# EAGLE design Ver2 (EAGLE 9.2.0)
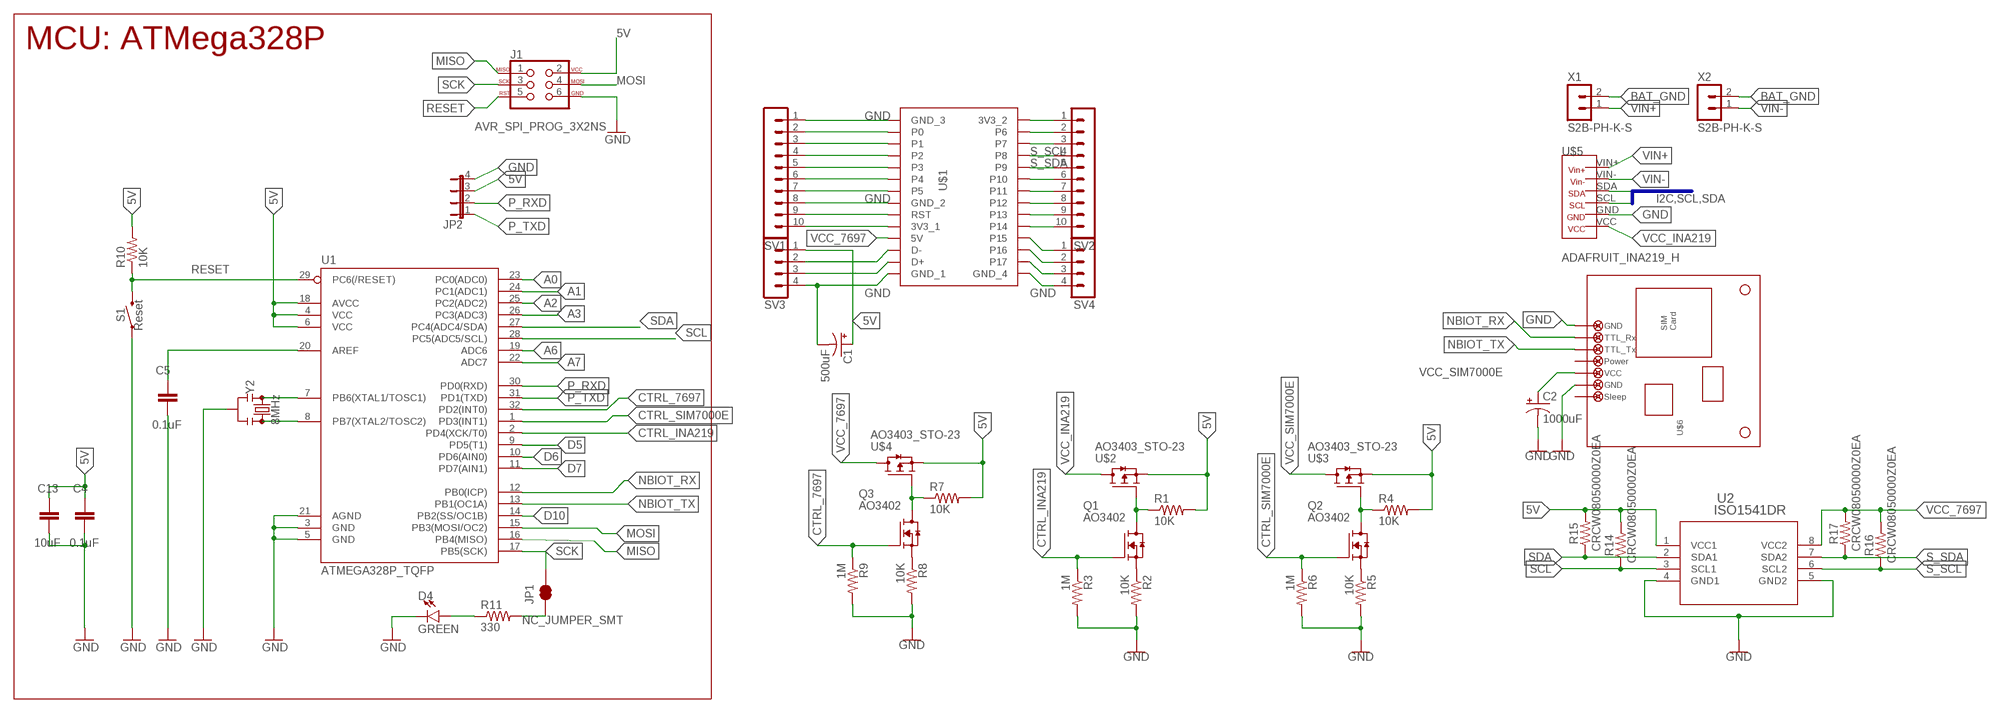
[diagram p0: schematic, sheet 1]

## Parts
C1  500uF  CPOL-USTT2D5  [TT2D5]
C2  1000uF  CPOL-USTT2D5L  [TT2D5L]
C4  0.1uF  CC0805KRX7R9BB104  [CAP_0805]
C5  0.1uF  CC0805KRX7R9BB104  [CAP_0805]
C13  10uF  CC0805KRX7R9BB104  [CAP_0805]
D4  GREEN  LED-GREEN0603  [LED-0603]
J1  AVR_SPI_PROG_3X2NS  [2X3-NS]
JP1  NC_JUMPER_SMT  JUMPER-SMT_2_NC_TRACE_SILK  [SMT-JUMPER_2_NC_TRACE_SILK]
JP2  JP4E  [JP4]
Q1  AO3402  [SOT95P280X125-3N]
Q2  AO3402  [SOT95P280X125-3N]
Q3  AO3402  [SOT95P280X125-3N]
R1  10K  CRCW08050000Z0EA  [RES_0805]
R2  10K  CRCW08050000Z0EA  [RES_0805]
R3  1M  CRCW08050000Z0EA  [RES_0805]
R4  10K  CRCW08050000Z0EA  [RES_0805]
R5  10K  CRCW08050000Z0EA  [RES_0805]
R6  1M  CRCW08050000Z0EA  [RES_0805]
R7  10K  CRCW08050000Z0EA  [RES_0805]
R8  10K  CRCW08050000Z0EA  [RES_0805]
R9  1M  CRCW08050000Z0EA  [RES_0805]
R10  10K  CRCW08050000Z0EA  [RES_0805]
R11  330  CRCW08050000Z0EA  [RES_0805]
R14  CRCW08050000Z0EA  [RES_0805]
R15  CRCW08050000Z0EA  [RES_0805]
R16  CRCW08050000Z0EA  [RES_0805]
R17  CRCW08050000Z0EA  [RES_0805]
S1  Reset  MOMENTARY-SWITCH-SPST-SMD-4.5MM  [TACTILE_SWITCH_SMD_4.5MM]
SV1  MA10-1  [MA10-1]
SV2  MA10-1  [MA10-1]
SV3  MA04-1  [MA04-1]
SV4  MA04-1  [MA04-1]
U1  ATMEGA328P_TQFP  [TQFP32-08]
U2  ISO1541DR  [D8]
U$1  LINKIT_7697  [LINKIT_7697]
U$2  AO3403_STO-23  [SOT23]
U$3  AO3403_STO-23  [SOT23]
U$4  AO3403_STO-23  [SOT23]
U$5  ADAFRUIT_INA219_H  [ADAFRUIT_INA219_H]
U$6  SIM7000E  [SIM7000E_AND-GLOBAL]
X1  S2B-PH-K-S  [S2B-PH-K-S]
X2  S2B-PH-K-S  [S2B-PH-K-S]
Y2  8MHz  RESONATOR-8MHZSMD_3.2X1.3  [RESONATOR-SMD-3.2X1.3]

## Nets
5V: C1.+ C4.1 C13.1 J1.2 JP2.3 R1.2 R4.2 R7.2 R10.2 R14.2 R15.2 SV3.1 U1.4(VCC) U1.6(VCC) U1.18(AVCC) U2.1(VCC1) U$2.2(S) U$3.2(S) U$4.2(S)
A0: U1.23(PC0(ADC0))
A1: U1.24(PC1(ADC1))
A2: U1.25(PC2(ADC2))
A3: U1.26(PC3(ADC3))
A6: U1.19(ADC6)
A7: U1.22(ADC7)
BAT_GND: X1.2 X2.2
CTRL_7697: Q3.1(G) R9.1 U1.32(PD2(INT0))
CTRL_INA219: Q1.1(G) R3.1 U1.2(PD4(XCK/T0))
CTRL_SIM7000E: Q2.1(G) R6.1 U1.1(PD3(INT1))
D5: U1.9(PD5(T1))
D6: U1.10(PD6(AIN0))
D7: U1.11(PD7(AIN1))
D10: U1.14(PB2(SS/OC1B))
GND: C1.- C2.- C4.2 C5.2 C13.2 D4.C J1.6 JP2.4 R2.2 R3.2 R5.2 R6.2 R8.2 R9.2 S1.2 S1.3 SV1.1 SV1.8 SV3.4 SV4.4 U1.3(GND) U1.5(GND) U1.21(AGND) U2.4(GND1) U2.5(GND2) U$1.GND_1 U$1.GND_2 U$1.GND_3 U$1.GND_4 U$5.GND U$6.S_GND U$6.V_GND Y2.2
MISO: J1.1 U1.16(PB4(MISO))
MOSI: J1.4 U1.15(PB3(MOSI/OC2))
N$1: Q1.2(S) R2.1
N$2: Q1.3(D) R1.1 U$2.1(G)
N$3: Q2.2(S) R5.1
N$4: Q2.3(D) R4.1 U$3.1(G)
N$5: Q3.2(S) R8.1
N$6: Q3.3(D) R7.1 U$4.1(G)
N$7: U1.7(PB6(XTAL1/TOSC1)) Y2.1
N$8: SV1.2 U$1.P0
N$9: SV1.3 U$1.P1
N$10: SV1.4 U$1.P2
N$11: SV1.5 U$1.P3
N$12: SV1.6 U$1.P4
N$13: SV1.7 U$1.P5
N$14: U1.8(PB7(XTAL2/TOSC2)) Y2.3
N$15: SV1.9 U$1.RST
N$16: SV1.10 U$1.3V3_1
N$17: SV3.2 U$1.D-
N$18: SV3.3 U$1.D+
N$19: C5.1 U1.20(AREF)
N$20: JP1.1 R11.2
N$21: SV4.3 U$1.P17
N$22: SV4.2 U$1.P16
N$23: SV4.1 U$1.P15
N$24: SV2.10 U$1.P14
N$25: SV2.9 U$1.P13
N$26: SV2.8 U$1.P12
N$27: SV2.7 U$1.P11
N$28: SV2.6 U$1.P10
N$29: D4.A R11.1
N$31: SV2.3 U$1.P7
N$32: SV2.2 U$1.P6
N$33: SV2.1 U$1.3V3_2
NBIOT_RX: U1.12(PB0(ICP)) U$6.RX
NBIOT_TX: U1.13(PB1(OC1A)) U$6.TX
P_RXD: JP2.2 U1.30(PD0(RXD))
P_TXD: JP2.1 U1.31(PD1(TXD))
RESET: J1.5 R10.1 S1.1 S1.4 U1.29(PC6(/RESET))
S_SCL: R16.1 SV2.4 U2.6(SCL2) U$1.P8
S_SDA: R17.1 SV2.5 U2.7(SDA2) U$1.P9
SCK: J1.3 JP1.2 U1.17(PB5(SCK))
SCL: R14.1 U1.28(PC5(ADC5/SCL)) U2.3(SCL1) U$5.SCL
SDA: R15.1 U1.27(PC4(ADC4/SDA)) U2.2(SDA1) U$5.SDA
VCC_7697: R16.2 R17.2 U2.8(VCC2) U$1.5V U$4.3(D)
VCC_INA219: U$2.3(D) U$5.VCC
VCC_SIM7000E: C2.+ U$3.3(D) U$6.VCC
VIN+: U$5.VIN+ X1.1
VIN-: U$5.VIN- X2.1
Unconnected: U$6.PW U$6.SLEEP

## Buses
I2C,SCL,SDA

## Notes on the sheet
- MCU: ATMega328P

## Library data of the parts
C1 C2 = rcl:CPOL-US: POLARIZED CAPACITOR, American symbol; SPICEPREFIX: C
C4 C5 C13 = Resistor_Capacitor:CC0805KRX7R9BB104: CAP CER 0.1UF 50V X7R 0805 Manufacturer's datasheet <http://www.yageo.com/documents/recent/UPY-GPHC_X7R_6.3V-to-50V_18.pdf>; CREATED_BY: PCBLayout.com; DIGIKEY_PART_NUMBER: 311-1140-2-ND; MANUFACTURER: Yageo; MPN: CC0805KRX7R9BB104; PACKAGE: SMD 0805
D4 = SparkFun-LED:LED-GREEN: Green SMD LED Used in manufacturing of various products at SparkFun Packages: 0603 - SMD 0603 package [Product Link] <http://www.futureelectronics.com/en/technologies/semiconductors/optoelectronics/leds/Pages/9894312-LTST-C190GKT.aspx?CrossPart=HSMG-C190&IM=0> LilyPad 1206 - SMD1206 LilyPad package [Product Link] <http://www.futureelectronics.com/en/Technologies/Product.aspx?ProductID=IN150NGHARVATEKCORPORATION2049943&IM=0> 1206 - SMD1206 package [Product Link] <http://www.futureelectronics.com/en/technologies/semiconductors/optoelectronics/leds/Pages/8315665-LTST-C150KGKT.aspx?IM=0> 1206 Bottom Mount -SMD 1206 Bottom Mount [Product Link] <http://www.digikey.com/product-detail/en/lite-on-inc/LTST-C230KGKT/160-1456-1-ND/386854> SparkFun Products: Pro Mini 328 -5V <https://www.sparkfun.com/products/821> RedBoard <https://www.sparkfun.com/products/12757> MP3 Trigger <https://www.sparkfun.com/products/13720> Makey Makey <https://www.sparkfun.com/products/11076>; PROD_ID: DIO-00821
J1 = SparkFun-Connectors:AVR_SPI_PROG_3X2: AVR ISP 6 Pin This is the reduced ISP connector for AVR programming. Common on Arduino. This footprint will take up less PCB space and can be used with a 10-pin to 6-pin adapter such as SKU: BOB-08508 **Special note about "TEST_POINT" package. The stop mask is on the top side, so if you want your programming test points to be on the bottom of your board, make sure to place this package on the bottom side of the board. This also ensure that the orientation to program from the bottom side will be correct. SparkFun Products: SparkFun ISP Pogo Adapter <https://www.sparkfun.com/products/11591> - NS Tiny AVR Programmer <https://www.sparkfun.com/products/11801> -PTH
JP1 = SparkFun-Jumpers:JUMPER-SMT_2_NC_TRACE: Normally closed trace jumper This jumper has a trace between two pads so it's normally closed (NC). Use a razor knife to open the connection. For best results follow the IPC guidelines for cutting traces: Cutout at least 0.063 mm (0.005 in). Remove all loose material to clean up the cut area. Seal the cut with an approved epoxy. Reapply solder to reclose the connection.
JP2 = jumper:JP4E: JUMPER
Q1-Q3 = AO340x:AO3402: MOSFET N-CH 30V 4.0A SOT23; AVAILABILITY: Unavailable; DESCRIPTION: N-Channel 30V 4A _Ta_ 1.4W _Ta_ Surface Mount SOT-23-3L; MF: Alpha &; MP: AO3402; PACKAGE: SOT-23 Alpha &amp; Omega Semiconductor; PRICE: None
R1-R11 R14-R17 = Resistor_Capacitor:CRCW08050000Z0EA: RES SMD 0 OHM JUMPER 1/8W 0805 Manufacturer's datasheet <http://www.vishay.com/docs/20035/dcrcwe3.pdf>; CREATED_BY: PCBLayout.com; DIGIKEY_PART_NUMBER: 541-0.0ATR-ND; MANUFACTURER: Vishay Dale; MPN: CRCW08050000Z0EA; PACKAGE: SMD 0805
S1 = SparkFun-Switches:MOMENTARY-SWITCH-SPST: Momentary Switch (Pushbutton) - SPST Normally-open (NO) SPST momentary switches (buttons, pushbuttons). Variants PTH-12MM - 12mm square, through-hole Momentary Pushbutton Switch - 12mm Square <https://www.sparkfun.com/products/9190> (COM-09190) PTH-6.0MM, PTH-6.0MM-KIT - 6.0mm square, through-hole Mini Pushbutton Switch <https://www.sparkfun.com/products/97> (COM-00097) KIT package intended for soldering kit's - only one side of pads' copper is exposed. PTH-RIGHT-ANGLE-KIT - Right-angle, through-hole Right Angle Tactile Button <https://www.sparkfun.com/products/10791> - Used on SparkFun BigTime Watch Kit <https://www.sparkfun.com/products/11734> SMD-12MM - 12mm square, surface-mount Tactile Button - SMD (12mm) <https://www.sparkfun.com/products/12993> (COM-12993) Used on SparkFun PicoBoard <https://www.sparkfun.com/products/11888> SMD-4.5MM - 4.5mm Square Trackball Switch Used on SparkFun Blackberry Trackballer Breakout <https://www.sparkfun.com/products/13169> SMD-4.6MMX2.8MM - 4.60mm x 2.80mm, surface mount Used on SparkFun SAMD21 Mini Breakout <https://www.sparkfun.com/products/13664> SMD-5.2MM, SMD-5.2-REDUNDANT - 5.2mm square, surface-mount Mini Pushbutton Switch - SMD <https://www.sparkfun.com/products/8720> (COM-08720) Used on Arduino Pro Mini <https://www.sparkfun.com/products/11114> REDUNDANT package connects both switch circuits together SMD-6.0X3.5MM - 6.0 x 3.5mm, surface mount Momentary Reset Switch SMD <https://www.sparkfun.com/products/8229> (COM-08229) SMD-6.2MM-TALL - 6.2mm square, surface mount Tactile Button - SMD (6mm) <https://www.sparkfun.com/products/12992> Used on SparkFun Digital Sandbox <https://www.sparkfun.com/products/12651> SMD-RIGHT-ANGLE - Right-angle, surface mount Used on SparkFun Block for Intel® Edison - Arduino <https://www.sparkfun.com/products/13036>; PROD_ID: SWCH-09213
SV1 SV2 = con-lstb:MA10-1: PIN HEADER; OC_FARNELL: unknown; OC_NEWARK: unknown
SV3 SV4 = con-lstb:MA04-1: PIN HEADER; OC_FARNELL: unknown; OC_NEWARK: unknown
U1 = GAIA_LoRaMesh:ATMEGA328P_TQFP: Popular 328P in QFP Storefront component: ATmega328 - TQFP <https://www.sparkfun.com/products/13448> (COM-13448) Datasheet <http://www.sparkfun.com/datasheets/Components/SMD/ATMega328.pdf> SparkFun Products SparkFun RedBoard - Programmed with Arduino <https://www.sparkfun.com/products/12757> (DEV-12757) Arduino Pro Mini 328 - 5V/16MHz <https://www.sparkfun.com/products/11113> (DEV-11113) Arduino Pro Mini 328 - 3.3V/8MHz <https://www.sparkfun.com/products/11114> (DEV-11114) SparkFun OpenLog <https://www.sparkfun.com/products/13712> (DEV-13712) SparkFun MicroView - OLED Arduino Module <https://www.sparkfun.com/products/12923> (DEV-12923) SparkFun Digital Sandbox <https://www.sparkfun.com/products/12651> (DEV-12651) SparkFun PicoBoard <https://www.sparkfun.com/products/11888> (WIG-11888) Arduino Fio <https://www.sparkfun.com/products/10116> (DEV-10116) LilyPad Arduino 328 Main Board <https://www.sparkfun.com/products/13342> (DEV-13342) SparkFun RedStick <https://www.sparkfun.com/products/13741> (DEV-13741) LilyPad MP3 <https://www.sparkfun.com/products/11013> (DEV-11013) LilyPad Arduino SimpleSnap <https://www.sparkfun.com/products/10941> (DEV-10941) SparkFun Stepoko <https://www.sparkfun.com/products/13899> (ROB-13899) SparkFun Geiger Counter <https://www.sparkfun.com/products/11345> (SEN-11345) SparkFun EL Sequencer <https://www.sparkfun.com/products/12781> (COM-12781) Arduino Pro 328 - 5V/16MHz <https://www.sparkfun.com/products/10915> (DEV-10915) CryptoCape <https://www.sparkfun.com/products/12773> (DEV-12773) SparkFun IR Thermometer Evaluation Board - MLX90614 <https://www.sparkfun.com/products/10740> (SEN-10740) SparkFun RedBot Mainboard <https://www.sparkfun.com/products/12097> (ROB-12097) Arduino Pro 328 - 3.3V/8MHz <https://www.sparkfun.com/products/10914> (DEV-10914) SparkFun Block for Intel® Edison - Arduino <https://www.sparkfun.com/products/13036> (DEV-13036) SparkFun Simon Says - Surface Mount Soldering Kit <https://www.sparkfun.com/products/10935> (KIT-10935) SparkFun 7-Segment Serial Display - Red <https://www.sparkfun.com/products/11441> (COM-11441) SparkFun 7-Segment Serial Display - White <https://www.sparkfun.com/products/11629> (COM-11629) SparkFun 7-Segment Serial Display - Yellow <https://www.sparkfun.com/products/11443> (COM-11443) SparkFun 7-Segment Serial Display - Kelly Green <https://www.sparkfun.com/products/11440> (COM-11440) SparkFun 7-Segment Serial Display - Blue <https://www.sparkfun.com/products/11442> (COM-11442) SparkFun OpenSegment Serial Display - 20mm (Blue) <https://www.sparkfun.com/products/11647> (COM-11647) SparkFun OpenSegment Serial Display - 20mm (Green) <https://www.sparkfun.com/products/11646> (COM-11646) SparkFun OpenSegment Serial Display - 20mm (White) <https://www.sparkfun.com/products/11648> (COM-11648) SparkFun OpenSegment Serial Display - 20mm (Red) <https://www.sparkfun.com/products/11644> (COM-11644) SparkFun OpenSegment Serial Display - 20mm (Yellow) <https://www.sparkfun.com/products/11645> (COM-11645) SparkFun OpenSegment Shield <https://www.sparkfun.com/products/13190> (DEV-13190); PROD_ID: IC-09069
U2 = IC_I2CIsolator_ISO1451DR:ISO1541DR; BUILT_BY: EMA_UL_Team; MANUFACTURER_PART_NUMBER: ISO1541DR; VENDOR: Texas Instruments
U$1 = MCU:LINKIT_7697
U$2-U$4 = AO340x:AO3403
U$5 = GAIA_SedimentCurrentFlowBox:ADAFRUIT_INA219_H
U$6 = GAIA_SedimentCurrentFlowBox:SIM7000E
X1 X2 = con-JST PH:S2B-PH: JST PH series header 2.00mm pitch disconnectable crimp style connectors, horizontal (side entry type), 2 pins
Y2 = SparkFun-Clocks:RESONATOR-8MHZ: 8MHz Resonator Digikey Example <http://www.digikey.com/product-detail/en/murata-electronics-north-america/CSTCE10M0G55-R0/490-1196-1-ND/584633> Frequency: 8MHz Frequency Stability: ±0.2% Frequency Tolerance: ±0.5% Capacitance: 33pF SparkFun Products Arduino Pro Mini 328- 3.3V/8MHz <https://www.sparkfun.com/products/11114> SparkFun Digital Sandbox <https://www.sparkfun.com/products/12651>; PROD_ID: XTAL-08895

## Board
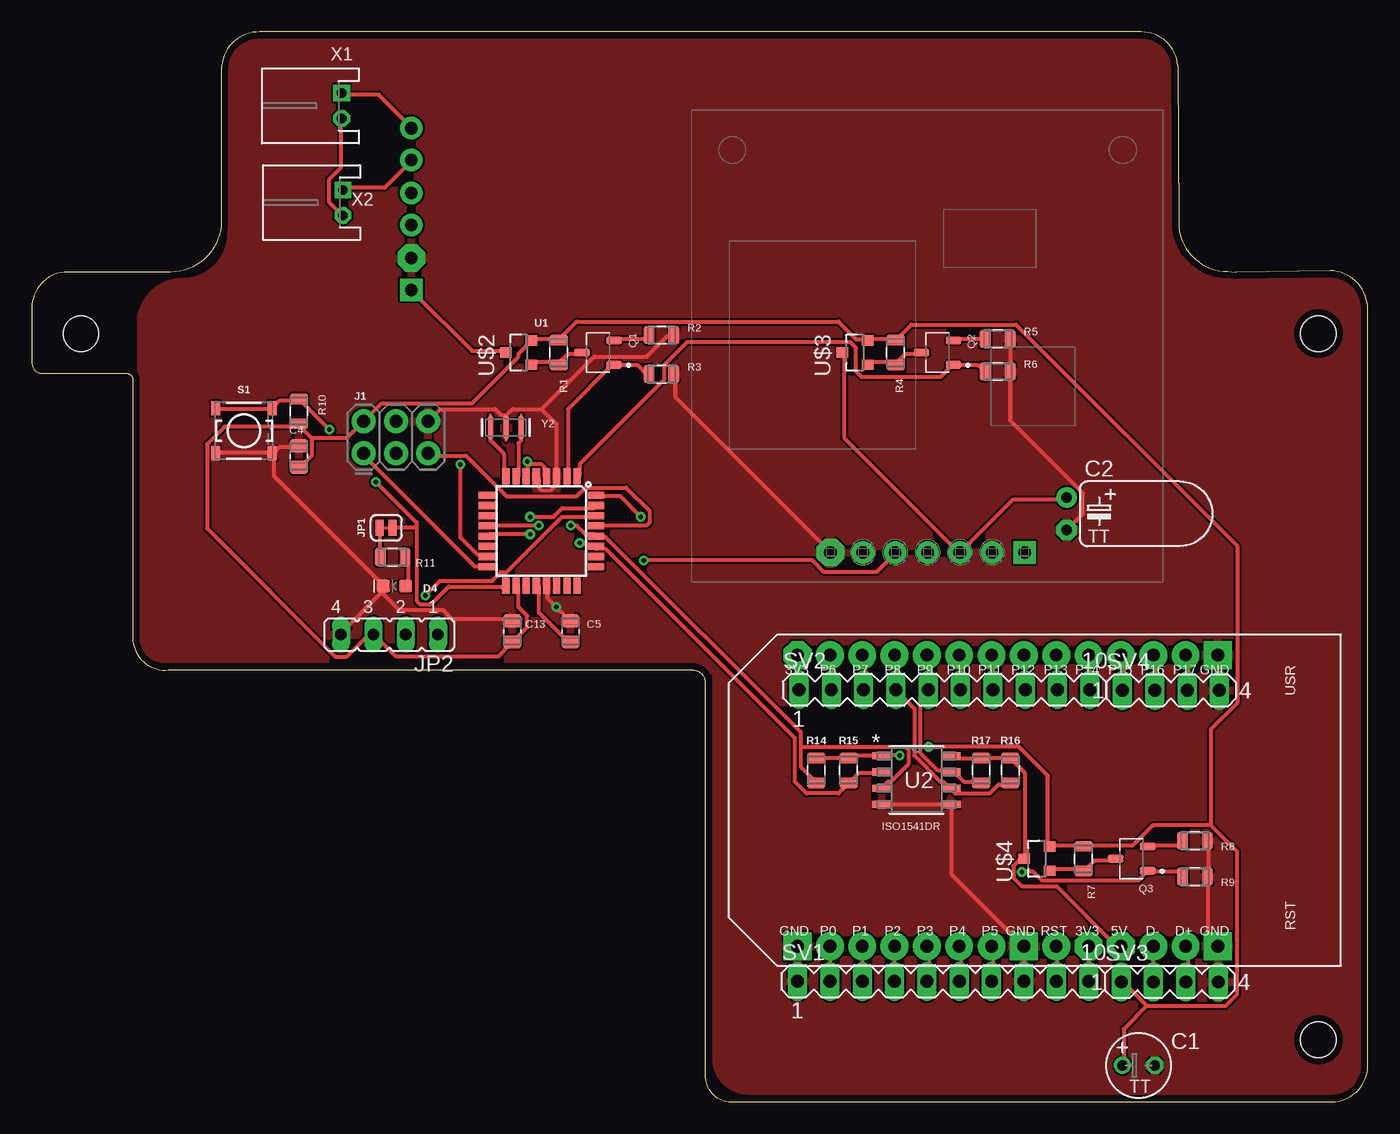
[diagram p1: board, top side]
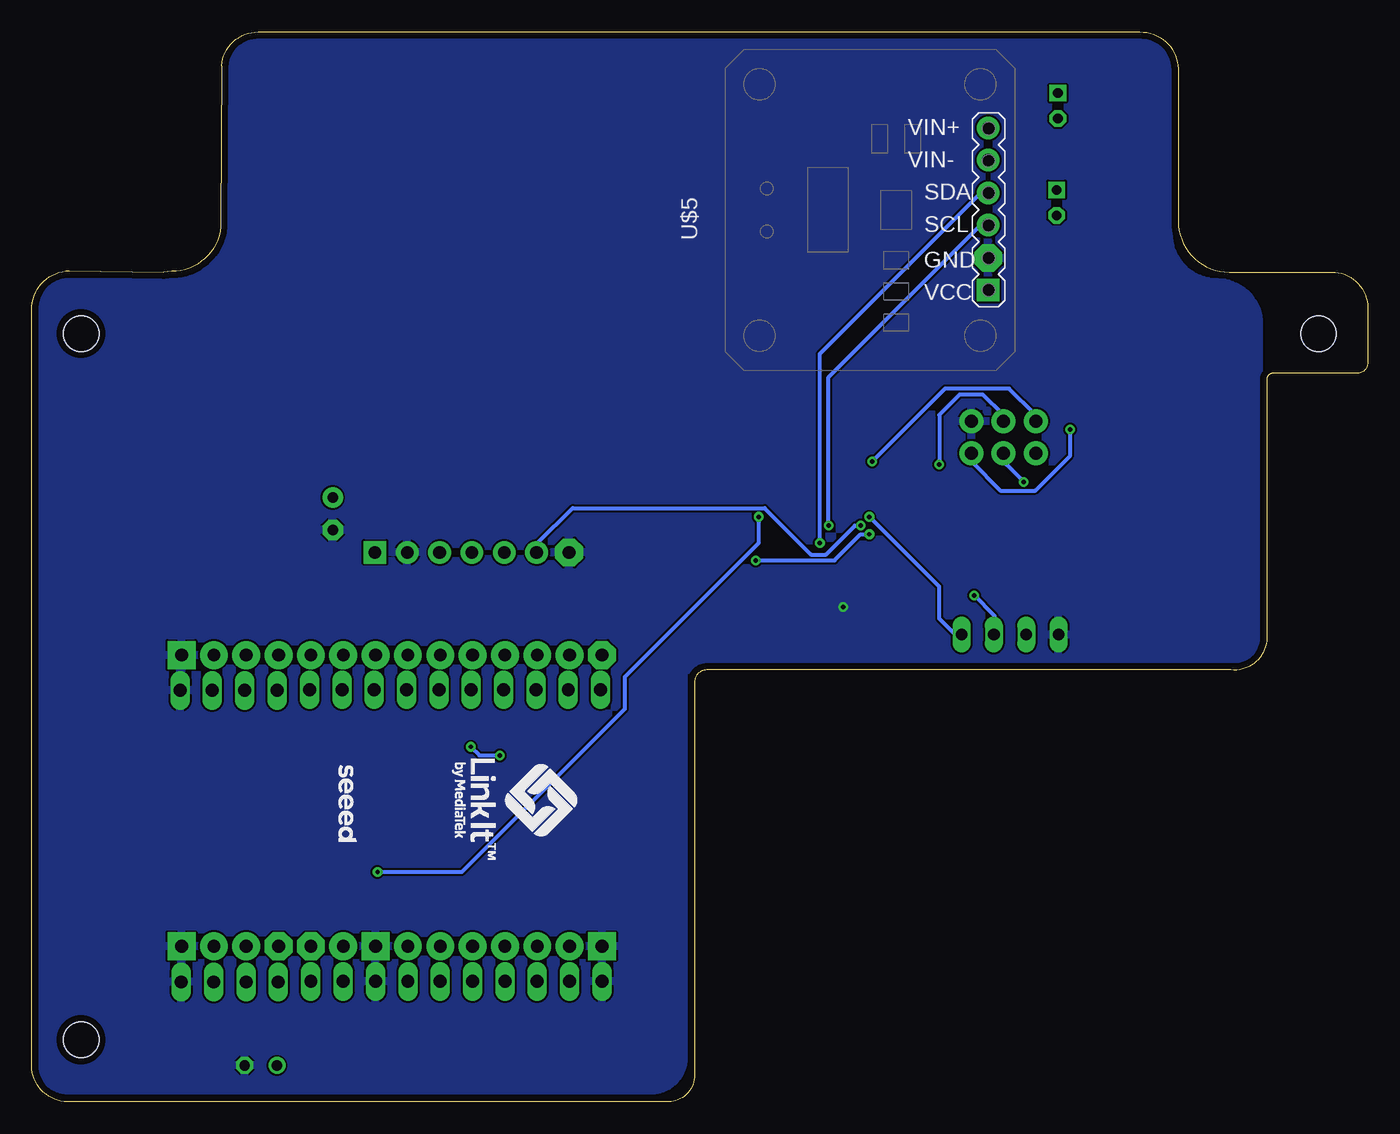
[diagram p2: board, bottom side, seen from below]

Size 104.94 x 84.01 mm. Coordinates in mm from the lower left corner, seen from the top.
Outline: 3.29,65.15 3.24,65.15
Outline: 3.24,65.15 2.81,65.15 arc90 0,62.34 0,58.02 arc90 0.82,57.2 7.44,57.2 arc-90 7.94,56.7 7.94,36.2 arc90 10.74,33.9 51.94,33.9 arc-90 52.89,32.9 52.89,2.3 arc90 54.74,0 102.14,0 arc90 104.94,2.8 104.94,62.2 arc90 101.99,65.25 94.59,65.15 93.94,65.2 arc-90 90.09,69.05 90.04,81.35 arc90 86.89,84 17.89,84 arc90 14.89,81.1 14.89,69.15 arc-90 10.89,65.15 3.24,65.15
Copper layers (1*16): Top 0.035mm / dielectric 1.5mm / Bottom 0.035mm
Design rules "default *": minimum track width 12mil, minimum drill 0.35mm, track to track 6mil, track to pad 6mil, pad to pad 6mil, via to via 6mil, smd to smd 6mil, copper to edge 20mil, drill to drill 6mil, minimum pad ring 10mil, minimum via ring 8mil, stop-mask expansion 6mil, vias tented up to drill 0mil, thermal gap 6mil
Holes 2.8 mm at 3.86,60.31 101.07,60.31 101.07,4.86

### Footprints (pad centres in the part's own frame; a part is rotated, then mirrored left to right if it is on the bottom)
TT2D5 = drill 0.813: + -1.27,0 | drill 0.813 octagon: - 1.27,0
TT2D5L = drill 0.813 pad 1.6: + -1.27,0 | drill 0.813 pad 1.6 octagon: - 1.27,0
CAP_0805 = smd 1.05 x 1.38: 1 -0.84,0; 2 0.84,0
LED-0603 = smd 1 x 1: A -0.877,0; C 0.877,0
2X3-NS = drill 1.016 pad 1.88: 1 -2.54,-1.27; 2 -2.54,1.27; 3 0,-1.27; 4 0,1.27; 5 2.54,-1.27; 6 2.54,1.27
SMT-JUMPER_2_NC_TRACE_SILK = smd 0.635 x 1.27: 1 -0.508,0; 2 0.508,0
JP4 = drill 0.914 long: 1 -3.81,0; 2 -1.27,0; 3 1.27,0; 4 3.81,0
SOT95P280X125-3N = smd 1.21 x 0.59: 1 -1.255,0.95; 2 -1.255,-0.95; 3 1.255,0
RES_0805 = smd 0.87 x 1.42: 1 -0.975,0; 2 0.975,0
TACTILE_SWITCH_SMD_4.5MM = smd 0.7 x 1.1: 1 2.225,1.75; 2 2.225,-1.75; 3 -2.225,-1.75; 4 -2.225,1.75
MA10-1 = drill 1.016 long: 1 -11.43,0; 2 -8.89,0; 3 -6.35,0; 4 -3.81,0; 5 -1.27,0; 6 1.27,0; 7 3.81,0; 8 6.35,0; 9 8.89,0; 10 11.43,0
MA04-1 = drill 1.016 long: 1 -3.81,0; 2 -1.27,0; 3 1.27,0; 4 3.81,0
TQFP32-08 = smd 1.27 x 0.559: 1 -4.293,2.8; 2 -4.293,2; 3 -4.293,1.2; 4 -4.293,0.4; 5 -4.293,-0.4; 6 -4.293,-1.2; 7 -4.293,-2; 8 -4.293,-2.8; 17 4.293,-2.8; 18 4.293,-2; 19 4.293,-1.2; 20 4.293,-0.4; 21 4.293,0.4; 22 4.293,1.2; 23 4.293,2; 24 4.293,2.8 | smd 0.559 x 1.27: 9 -2.8,-4.293; 10 -2,-4.293; 11 -1.2,-4.293; 12 -0.4,-4.293; 13 0.4,-4.293; 14 1.2,-4.293; 15 2,-4.293; 16 2.8,-4.293; 25 2.8,4.293; 26 2,4.293; 27 1.2,4.293; 28 0.4,4.293; 29 -0.4,4.293; 30 -1.2,4.293; 31 -2,4.293; 32 -2.8,4.293
D8 = smd 1.455 x 0.568: 1 -2.721,1.905; 2 -2.721,0.635; 3 -2.721,-0.635; 4 -2.721,-1.905; 5 2.721,-1.905; 6 2.721,-0.635; 7 2.721,0.635; 8 2.721,1.905
LINKIT_7697 = drill 1 pad 2.184 octagon: 3V3_1 1.524,19.812; 3V3_2 24.384,42.672; 5V 1.524,17.272 | drill 1 pad 2.184: D+ 1.524,12.192; D- 1.524,14.732; P0 1.524,40.132; P1 1.524,37.592; P2 1.524,35.052; P3 1.524,32.512; P4 1.524,29.972; P5 1.524,27.432; P6 24.384,40.132; P7 24.384,37.592; P8 24.384,35.052; P9 24.384,32.512; P10 24.384,29.972; P11 24.384,27.432; P12 24.384,24.892; P13 24.384,22.352; P14 24.384,19.812; P15 24.384,17.272; P16 24.384,14.732; P17 24.384,12.192; RST 1.524,22.352 | drill 1 pad 2.184 square: GND_1 1.524,9.652; GND_2 1.524,24.892; GND_3 1.524,42.672; GND_4 24.384,9.652
SOT23 = smd 0.8 x 0.9: 1 -0.95,-1; 2 0.95,-1; 3 0,1
ADAFRUIT_INA219_H = drill 1 pad 2.184 octagon: GND -3.806,-7.585 | drill 1 pad 1.778: SCL -1.206,-7.585; SDA 1.294,-7.585; VIN+ 6.394,-7.585; VIN- 3.894,-7.585 | drill 1 pad 1.778 square: VCC -6.306,-7.585
SIM7000E_AND-GLOBAL = drill 1 pad 1.778: PW 1.524,17.018; RX 6.604,17.018; TX 4.064,17.018; V_GND -3.556,17.018; VCC -1.016,17.018 | drill 1 pad 2.184 octagon: S_GND 9.144,17.018 | drill 1 pad 1.778 square: SLEEP -6.096,17.018
S2B-PH-K-S = drill 0.75 pad 1.3 square: 1 1,0 | drill 0.75 pad 1.3 octagon: 2 -1,0
RESONATOR-SMD-3.2X1.3 = smd 0.45 x 1.905: 1 -1.2,0; 2 0,0; 3 1.2,0

### Placement (x,y rotation side)
C1  86.95,2.85 0 top
C2  81.3,46.17 270 top
C4  20.98,50.65 90 top
C5  42.32,36.94 90 top
C13  37.74,36.94 90 top
D4  28.48,40.49 180 top
J1  28.6,52.18 0 top
JP1  27.84,45.07 0 top
JP2  28.09,36.68 180 top
Q1  44.48,58.83 180 top
Q2  71.15,58.83 180 top
Q3  86.39,19.08 180 top
R1  41.39,58.83 90 top
R2  49.46,60.2 0 top
R3  49.46,57.13 0 top
R4  67.84,58.83 90 top
R5  75.87,59.9 0 top
R6  75.87,57.34 0 top
R7  82.61,19.08 90 top
R8  91.37,20.49 0 top
R9  91.37,17.67 0 top
R10  20.98,54.21 270 top
R11  28.35,42.76 180 top
R14  61.62,26.02 90 top
R15  64.16,26.02 90 top
R16  76.86,26.02 90 top
R17  74.57,26.02 90 top
S1  16.66,52.69 0 top
SV1  71.59,9.45 0 top
SV2  71.69,32.35 0 top
SV3  89.39,9.4 0 top
SV4  89.49,32.3 0 top
U1  40.03,44.81 270 top
U2  69.49,25.25 0 top
U$1  102.82,10.68 90 top
U$2  38.25,58.83 90 top
U$3  64.66,58.83 90 top
U$4  78.95,19.08 90 top
U$5  37.4,70.05 90 bottom
U$6  71.89,60.15 180 top
X1  24.34,78.2 90 top
X2  24.44,70.6 90 top
Y2  37.24,52.94 180 top

### Tracks (layer width: path | path; a pad name or v marks a point on that pad's centre or on a via)
5V  (via drill 0.35)
  Top 0.305: R14.2 61.77,26.96 64.06,26.96 R15.2 64.29,27.18 66.57,27.18 U2.1 66.8,27.18 v68.17,27.18 | 92.63,21.7 88.06,21.7 86.46,20.1 82.8,20.1 R7.2 82.58,20.1 80.06,20.1 U$4.2 79.83,20.1 79.83,25.58 77.55,27.87 v70.46,27.87 | 92.63,21.7 94.69,19.64 94.69,8.44 93.78,7.53 87.6,7.53 | 87.6,7.53 85.78,9.35 SV3.1 | 87.6,7.53 85.78,5.7 85.78,2.95 C1.+ | U1.18 38.23,40.44 38.23,38.84 38.91,38.16 38.91,37.24 37.77,36.1 C13.1 37.54,35.87 36.63,34.96 28.63,34.96 27.03,36.56 JP2.3 26.8,36.56 26.34,36.56 24.74,34.96 23.83,34.96 13.77,45.02 13.77,51.64 15.14,53.02 20.85,53.02 R10.2 21.08,53.02 22,52.1 | 22,52.1 22,50.73 21.08,49.82 C4.1 | 39.14,50.04 38.91,49.82 38.91,49.13 U1.6 | 39.14,50.04 40.06,50.04 40.28,49.82 40.28,49.13 U1.4 | v38.91,50.27 39.14,50.04 | 22,52.1 24.74,52.1 25.88,53.24 J1.2 26.11,53.47 27.48,54.84 34.57,54.84 38.23,58.5 38.23,58.73 39.14,59.65 U$2.2 39.37,59.87 41.2,59.87 R1.2 41.43,59.87 42.8,61.25 63.37,61.25 64.74,59.87 65.66,59.87 U$3.2 65.89,59.87 67.72,59.87 R4.2 67.95,59.87 69.09,61.02 77.32,61.02 94.69,43.64 94.69,31.3 92.63,29.24 92.63,21.7
  Bottom 0.305: v68.17,27.18 69.77,27.18 v70.46,27.87 | v38.91,50.27 33.2,55.99 28.17,55.99 26.11,53.93 26.11,53.47 J1.2
BAT_GND
  Top 0.305: X1.2 24.28,77.02 24.28,73.36 23.37,72.45 23.37,70.62 24.28,69.7 X2.2
CTRL_7697  (via drill 0.35)
  Top 0.305: R9.1 90.35,17.81 90.12,18.04 87.83,18.04 Q3.1 87.6,18.04 86.92,17.36 79.38,17.36 78.69,18.04 v77.77,18.04 | v47.83,45.93 46.23,47.53 44.4,47.53 U1.32
  Bottom 0.305: v47.83,45.93 47.83,43.87 58.34,33.36 58.34,30.84 71.15,18.04 v77.77,18.04
CTRL_INA219
  Top 0.305: R3.1 48.29,57.13 47.6,57.82 45.77,57.82 Q1.1 45.54,57.82 42.11,54.39 42.11,49.13 U1.2
CTRL_SIM7000E
  Top 0.305: R6.1 74.8,57.36 74.35,57.82 72.52,57.82 Q2.1 72.29,57.82 71.37,56.9 65.2,56.9 64.74,57.36 64.74,59.19 64.29,59.65 51.49,59.65 49.66,57.82 49.66,56.67 43.03,50.04 43.03,49.13 U1.1
GND  (via drill 0.35)
  Top 0.305: U1.5 39.83,48.9 39.83,48.22 40.06,47.99 40.74,47.99 41.2,48.44 41.2,48.9 U1.3 41.2,49.13 41.2,53.24 40.06,54.39 | 40.06,54.39 44.17,58.5 48.29,58.5 49.89,60.1 50.34,60.1 R2.2 | 40.06,54.39 37.77,54.39 37.31,53.93 | 37.31,53.93 Y2.2 37.31,53.93 | S1.3 14.45,50.96 18.8,50.96 S1.2 | C4.2 20.85,51.42 19.48,51.42 19.02,50.96 S1.2 | U2.4 66.8,23.3 72.06,23.3 U2.5 72.29,23.3 72.29,17.81 77.77,12.32 U$1.GND_2 SV1.8 | U1.21 40.51,40.44 40.51,39.53 v41.2,38.84 42.11,37.93 C5.2 | R8.2 92.41,20.33 92.41,17.81 R9.2 92.41,17.58 92.41,13.01 93.09,12.32 U$1.GND_1 | R5.2 76.86,59.87 76.86,57.36 R6.2 76.86,57.13 76.86,53.47 82.58,47.76 82.58,46.16 81.43,45.02 C2.- | 27.48,39.99 27.48,40.44 D4.C 27.48,40.67 19.02,49.13 19.02,50.73 S1.2 | 27.48,39.99 24.28,36.79 JP2.4 | 27.48,39.99 28.85,38.61 32.28,38.61 32.97,37.93 37.54,37.93 C13.2 | R3.2 50.57,56.9 50.57,55.3 62.69,43.19 U$6.S_GND | 37.31,53.93 36.86,53.93 36.4,54.39 32.05,54.39 31.14,53.47 J1.6
  pour Bottom: 15.65,80.88 15.65,68.18 arc-90 11.84,64.37 arc90 8.53,61.07 8.53,35.92 arc90 10.57,33.89 53.75,33.89 53.75,3.41 arc90 56.29,0.87 102.01,0.87 arc90 104.55,3.41 104.55,61.83 arc90 102.01,64.37 94.39,64.37 arc-90 89.31,69.45 89.31,80.88 arc90 86.77,83.42 18.19,83.42 arc90
  pour Top: 86.46,83.73 41.43,83.73 18.15,83.38 arc90 15.65,80.88 15.65,68.18 arc-90 11.84,64.37 arc90 8.53,61.07 8.53,35.92 arc90 10.57,33.89 53.75,33.89 53.75,3.41 arc90 56.29,0.87 102.01,0.87 arc90 104.55,3.41 104.55,61.83 arc90 102.01,64.37 94.39,64.37 arc-90 89.31,69.45 89.31,80.88 arc90
MISO
  Top 0.305: U1.16 35.71,42.04 34.8,42.04 26.11,50.73 J1.1
MOSI  (via drill 0.35)
  Top 0.305: v33.66,50.04 33.66,44.33 35.03,42.96 35.71,42.96 U1.15
  Bottom 0.305: v33.66,50.04 33.66,53.93 32.05,55.53 30.23,55.53 28.63,53.93 28.63,53.47 J1.4
N$1
  Top 0.305: Q1.2 45.77,59.87 48.06,59.87 48.29,60.1 R2.1
N$2
  Top 0.305: U$2.1 39.37,58.05 41.2,58.05 R1.1 41.43,58.05 42.11,58.73 43.03,58.73 Q1.3
N$3
  Top 0.305: Q2.2 72.52,59.87 74.8,59.87 R5.1
N$4
  Top 0.305: U$3.1 65.89,58.05 67.72,58.05 R4.1 67.95,58.05 68.63,58.73 69.77,58.73 Q2.3
N$5
  Top 0.305: Q3.2 87.83,20.1 90.12,20.1 90.35,20.33 R8.1
N$6
  Top 0.305: U$4.1 80.06,18.27 82.58,18.27 R7.1 82.8,18.27 83.49,18.96 85.09,18.96 Q3.3
N$7
  Top 0.305: U1.7 38.23,49.13 38.23,51.72 38.44,51.92 Y2.1
N$8
  Top 0.305: SV1.2 62.69,9.58 62.69,12.1 U$1.P0
N$9
  Top 0.305: SV1.3 65.2,9.58 65.2,12.1 U$1.P1
N$10
  Top 0.305: SV1.4 67.72,9.58 67.72,12.1 U$1.P2
N$11
  Top 0.305: SV1.5 70.46,9.58 70.46,12.1 U$1.P3
N$12
  Top 0.305: SV1.6 72.97,9.58 72.97,12.1 U$1.P4
N$13
  Top 0.305: SV1.7 75.49,9.58 75.49,12.1 U$1.P5
N$14
  Top 0.305: U1.8 37.08,49.13 37.08,50.88 36.04,51.92 Y2.3
N$15
  Top 0.305: SV1.9 80.52,9.58 80.52,12.1 U$1.RST
N$16
  Top 0.305: SV1.10 83.03,9.58 83.03,12.1 U$1.3V3_1
N$17
  Top 0.305: SV3.2 88.06,9.58 88.06,12.1 U$1.D-
N$18
  Top 0.305: SV3.3 90.81,9.58 90.81,12.1 U$1.D+
N$19
  Top 0.305: U1.20 39.83,40.44 39.83,38.39 42.11,36.1 C5.1
N$20
  Top 0.305: JP1.1 27.33,42.8 R11.2
N$21
  Top 0.305: SV4.3 90.81,32.44 90.81,34.96 U$1.P17
N$22
  Top 0.305: SV4.2 88.29,32.44 88.29,34.96 U$1.P16
N$23
  Top 0.305: SV4.1 85.78,32.44 85.78,34.96 U$1.P15
N$24
  Top 0.305: SV2.10 83.03,32.44 83.03,34.96 U$1.P14
N$25
  Top 0.305: SV2.9 80.52,32.44 80.52,34.96 U$1.P13
N$26
  Top 0.305: SV2.8 78,32.44 78,34.96 U$1.P12
N$27
  Top 0.305: SV2.7 75.49,32.44 75.49,34.96 U$1.P11
N$28
  Top 0.305: SV2.6 72.97,32.44 72.97,34.96 U$1.P10
N$29
  Top 0.305: D4.A 29.54,40.67 29.54,42.73 R11.1
N$31
  Top 0.305: SV2.3 65.43,32.44 65.43,34.96 U$1.P7
N$32
  Top 0.305: SV2.2 62.92,32.44 62.92,34.96 U$1.P6
N$33
  Top 0.305: SV2.1 60.17,32.44 60.17,34.96 U$1.3V3_2
NBIOT_RX  (via drill 0.35)
  Top 0.305: v39.83,45.24 35.94,45.24 U1.12
  Bottom 0.305: v39.83,45.24 40.28,45.24 42.57,42.96 43.71,42.96 47.37,46.61 62.46,46.61 65.2,43.87 65.2,43.19 U$6.RX
NBIOT_TX  (via drill 0.35)
  Top 0.305: v39.14,44.56 35.94,44.56 U1.13 | v48.06,42.5 61.32,42.5 62.23,41.59 66.34,41.59 67.72,42.96 U$6.TX
  Bottom 0.305: v39.14,44.56 39.83,44.56 41.88,42.5 v48.06,42.5
P_RXD  (via drill 0.35)
  Top 0.305: v30.91,39.76 32.05,40.9 36.17,40.9 36.86,41.59 37.31,41.59 41.66,45.93 44.17,45.93 U1.30
  Bottom 0.305: v30.91,39.76 29.31,38.16 29.31,36.79 JP2.2
P_TXD  (via drill 0.35)
  Top 0.305: v39.14,45.93 40.97,45.93 41.66,46.61 44.17,46.61 U1.31
  Bottom 0.305: v39.14,45.93 33.66,40.44 33.66,37.93 32.51,36.79 32.05,36.79 JP2.1
RESET  (via drill 0.35)
  Top 0.305: S1.4 14.45,54.39 18.8,54.39 S1.1 19.02,54.62 19.48,55.07 20.85,55.07 R10.1 21.08,55.07 v23.37,52.79 | U1.29 44.4,45.24 48.29,45.24 48.51,45.47 48.51,46.39 46.69,48.22 43.48,48.22 42.8,47.53 37.31,47.53 34.11,50.73 31.14,50.73 J1.5
  Bottom 0.305: v23.37,52.79 23.37,50.73 26.11,47.99 28.85,47.99 31.14,50.27 31.14,50.73 J1.5
S_SCL
  Top 0.305: R16.1 76.86,24.9 75.95,24.9 75.26,24.21 72.52,24.21 72.29,24.44 U2.6 72.06,24.67 71.6,25.13 71.37,25.13 69.32,27.18 69.32,30.84 67.95,32.21 SV2.4 67.95,32.44 67.95,34.96 U$1.P8
S_SDA
  Top 0.305: R17.1 74.57,25.13 73.2,25.13 72.29,26.04 U2.7 72.06,26.04 71.15,26.04 69.77,27.41 69.77,31.76 70.23,32.21 SV2.5 70.46,32.44 70.46,34.96 U$1.P9
SCK  (via drill 0.35)
  Top 0.305: 30.23,45.07 30.23,45.47 v27.03,48.67 | 30.23,45.07 30.23,39.3 30.45,39.07 31.37,39.07 32.74,40.44 37.08,40.44 U1.17 | 30.23,45.07 JP1.2
  Bottom 0.305: v27.03,48.67 28.4,50.04 28.4,50.73 J1.3
SCL  (via drill 0.35)
  Top 0.305: 60.4,27.87 60.4,26.27 61.54,25.13 R14.1 | 60.4,27.87 60.4,29.01 45.09,44.33 44.4,44.33 U1.28 44.17,44.56 43.48,44.56 42.8,45.24 v42.34,45.24 | 60.4,27.87 68.63,27.87 68.86,27.64 68.86,26.5 67.49,25.13 67.26,25.13 66.8,24.67 U2.3
  Bottom 0.305: v42.34,45.24 42.34,56.9 30.45,68.79 30,68.79 U$5.SCL
SDA  (via drill 0.35)
  Top 0.305: U2.2 66.57,25.81 64.97,25.81 64.29,25.13 R15.1 64.06,24.9 63.37,24.21 60.86,24.21 59.94,25.13 59.94,28.56 45.09,43.42 44.4,43.42 U1.27 44.17,43.64 43.71,43.64 43.48,43.87 v43.03,43.87
  Bottom 0.305: v43.03,43.87 43.03,58.73 30.45,71.3 30,71.3 U$5.SDA
VCC_7697
  Top 0.305: 74.57,26.96 72.29,26.96 U2.8 | 74.57,26.96 R17.2 74.57,26.96 | 76.86,26.96 78,25.81 78,19.18 U$4.3 77.77,19.18 77.09,18.5 77.09,17.58 77.77,16.9 80.52,16.9 85.09,12.32 85.55,12.32 U$1.5V | 76.86,26.96 R16.2 76.86,26.96 | 76.86,26.96 74.57,26.96
VCC_INA219
  Top 0.305: U$2.3 37.08,58.96 34.57,58.96 30,63.53 U$5.VCC
VCC_SIM7000E
  Top 0.305: U$3.3 63.83,58.73 63.83,52.1 72.75,43.19 U$6.VCC 72.97,43.19 77.09,47.3 81.2,47.3 C2.+
VIN+
  Top 0.305: X1.1 24.51,79.08 27.25,79.08 29.77,76.56 U$5.VIN+
VIN-
  Top 0.305: X2.1 24.51,71.76 27.71,71.76 29.77,73.82 U$5.VIN-

### Text on the board
tTest: WaterBox / V2.1_Pro